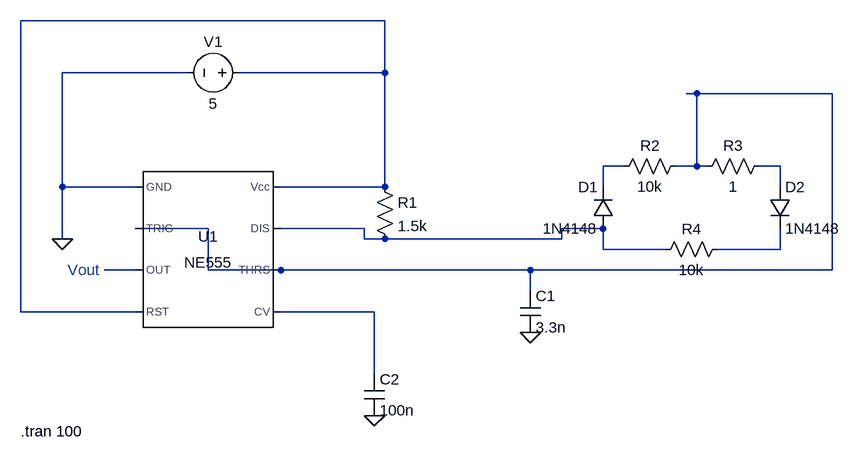
[diagram p0: schematic Sürücü devresi yarım.asc]
Sürücü devresi yarım.asc, the LTspice schematic file:
Version 4.1
SHEET 1 1064 680
WIRE 352 -208 -208 -208
WIRE 48 -128 -144 -128
WIRE 352 -128 352 -208
WIRE 352 -128 128 -128
WIRE 832 -96 816 -96
WIRE 1040 -96 832 -96
WIRE 720 16 688 16
WIRE 832 16 832 -96
WIRE 832 16 800 16
WIRE 848 16 832 16
WIRE 960 16 928 16
WIRE -144 48 -144 -128
WIRE -32 48 -144 48
WIRE 352 48 352 -128
WIRE 352 48 192 48
WIRE 688 48 688 16
WIRE 960 48 960 16
WIRE 80 112 -32 112
WIRE 320 112 192 112
WIRE 688 112 624 112
WIRE -144 128 -144 48
WIRE 320 128 320 112
WIRE 352 128 320 128
WIRE 624 128 624 112
WIRE 624 128 352 128
WIRE 688 144 688 112
WIRE 784 144 688 144
WIRE 960 144 960 112
WIRE 960 144 864 144
WIRE -32 176 -80 176
WIRE 80 176 80 112
WIRE 192 176 80 176
WIRE 576 176 192 176
WIRE 1040 176 1040 -96
WIRE 1040 176 576 176
WIRE 576 208 576 176
WIRE -208 240 -208 -208
WIRE -32 240 -208 240
WIRE 336 240 192 240
WIRE 336 336 336 240
FLAG -144 128 0
FLAG 336 400 0
FLAG 576 272 0
SYMBOL Misc\\NE555 80 144 R0
SYMATTR InstName U1
SYMBOL voltage 144 -128 R90
WINDOW 0 -32 56 VBottom 2
WINDOW 3 32 56 VTop 2
WINDOW 123 0 0 Left 0
WINDOW 39 0 0 Left 0
SYMATTR InstName V1
SYMATTR Value 5
SYMBOL res 336 32 R0
SYMATTR InstName R1
SYMATTR Value 1.5k
SYMBOL diode 704 112 R180
WINDOW 0 24 64 Left 2
WINDOW 3 24 0 Left 2
SYMATTR InstName D1
SYMATTR Value 1N4148
SYMBOL diode 944 48 R0
SYMATTR InstName D2
SYMATTR Value 1N4148
SYMBOL res 816 0 R90
WINDOW 0 0 56 VBottom 2
WINDOW 3 32 56 VTop 2
SYMATTR InstName R2
SYMATTR Value 10k
SYMBOL res 944 0 R90
WINDOW 0 0 56 VBottom 2
WINDOW 3 32 56 VTop 2
SYMATTR InstName R3
SYMATTR Value 1
SYMBOL res 880 128 R90
WINDOW 0 0 56 VBottom 2
WINDOW 3 32 56 VTop 2
SYMATTR InstName R4
SYMATTR Value 10k
SYMBOL cap 560 208 R0
SYMATTR InstName C1
SYMATTR Value 3.3n
SYMBOL cap 320 336 R0
SYMATTR InstName C2
SYMATTR Value 100n
TEXT -136 176 Left 2 ;Vout
TEXT -208 424 Left 2 !.tran 100

The netlist it stands for:
* Sürücü devresi yarım.asc
X§U1 0 N002 N007 N001 N008 N002 N005 N001 NE555  ; pins GND TRIG OUT RST CV THRS DIS Vcc
V1 N001 0 5
R1 N001 N005 1.5k
D1 N005 N003 1N4148
D2 N004 N006 1N4148
R2 N002 N003 10k
R3 N004 N002 1
R4 N006 N005 10k
C1 N002 0 3.3n
C2 N008 0 100n
.model D D
.lib standard.dio
* Vout
.tran 100
.lib NE555.sub
.backanno
.end